# Altium schematic sheet RJ45.SchDoc
size A4
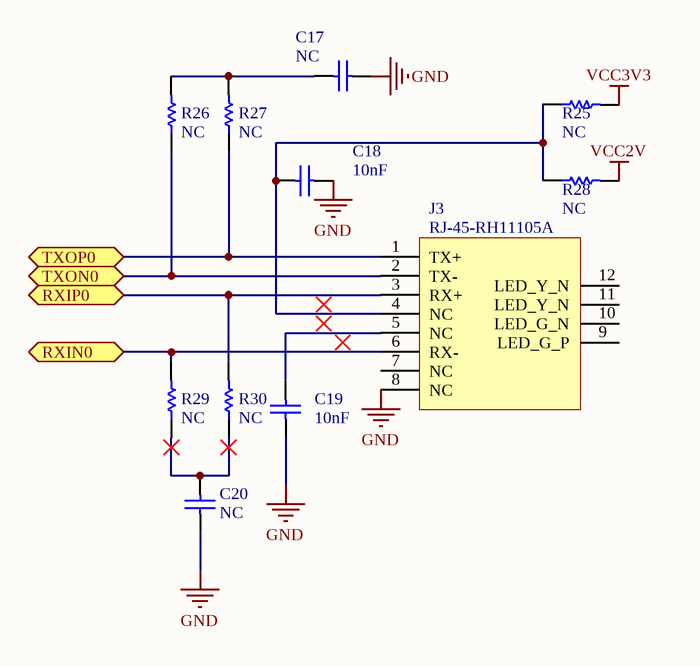
[diagram p0: RJ45.SchDoc]

## Parts
C17  NC  [0402]
C18  10nF  [0402]
C19  10nF  [0402]
C20  NC  [0402]
J3  RJ-45-RH11105A  [RJ-45-HR911105A]
R25  NC  [0402]
R26  NC  [0402]
R27  NC  [0402]
R28  NC  [0402]
R29  NC  [0402]
R30  NC  [0402]

## Ports
RXIN0 (bidir), RXIP0 (bidir), TXON0 (bidir), TXOP0 (bidir)

## Nets
GND: C17.2 C18.2 C19.1 C20.1 J3.8(NC)
VCC2V: R28.2
VCC3V3: R25.2
RXIN0: J3.6(RX-) R29.2 ; port RXIN0
RXIP0: J3.3(RX+) R30.2 ; port RXIP0
TXON0: J3.2(TX-) R26.1 ; port TXON0
TXOP0: J3.1(TX+) R27.1 ; port TXOP0
NetC17_1: C17.1 R26.2 R27.2
NetC18_1: C18.1 J3.4(NC) R25.1 R28.1
NetC19_2: C19.2 J3.5(NC)
NetC20_2: C20.2 R29.1 R30.1

Not connected (* = marked no-connect by the designer): J3 7(NC) 9(LED_G_P) 10(LED_G_N) 11(LED_Y_N) 12(LED_Y_N)

## Library data of the parts
C17-C20 = Cap Semi: Capacitor (Semiconductor SIM Model)
  C17 C20: Value: NC
  C18 C19: Value: 10nF
J3 = RJ-45-RH911105A: Value: RJ-45-RH11105A
R25-R30 = Res Semi: Semiconductor Resistor; Value: NC